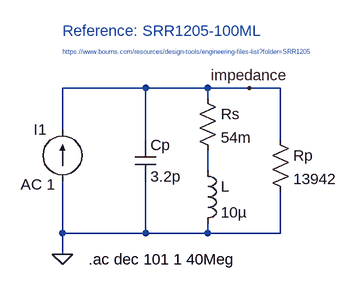
[diagram p0: schematic 06-SRR1205-100ML_bourns_linear_model.asc]
06-SRR1205-100ML_bourns_linear_model.asc, the LTspice schematic file:
Version 4
SHEET 1 1168 680
WIRE 96 64 -32 64
WIRE 192 64 96 64
WIRE 256 64 192 64
WIRE 304 64 256 64
WIRE 192 80 192 64
WIRE -32 128 -32 64
WIRE 96 144 96 64
WIRE 304 144 304 64
WIRE 192 192 192 160
WIRE -32 288 -32 208
WIRE 96 288 96 208
WIRE 96 288 -32 288
WIRE 192 288 192 272
WIRE 192 288 96 288
WIRE 304 288 304 224
WIRE 304 288 192 288
WIRE -32 320 -32 288
FLAG -32 320 0
FLAG 256 64 impedance
SYMBOL res 176 64 R0
SYMATTR InstName Rs
SYMATTR Value 54m
SYMBOL ind 176 176 R0
SYMATTR InstName L
SYMATTR Value 10µ
SYMBOL cap 80 144 R0
SYMATTR InstName Cp
SYMATTR Value 3.2p
SYMBOL res 288 128 R0
SYMATTR InstName Rp
SYMATTR Value 13942
SYMBOL current -32 208 R180
WINDOW 0 24 80 Left 2
WINDOW 3 24 0 Left 2
WINDOW 123 11 -5 Left 2
WINDOW 39 0 0 Left 0
SYMATTR InstName I1
SYMATTR Value ""
SYMATTR Value2 AC 1
TEXT 8 328 Left 2 !.ac dec 101 1 40Meg
TEXT -32 -24 Left 2 ;Reference: SRR1205-100ML
TEXT -32 8 Left 0 ;https://www.bourns.com/resources/design-tools/engineering-files-list?folder=SRR1205

The netlist it stands for:
* 06-SRR1205-100ML_bourns_linear_model.asc
Rs impedance N001 54m
L N001 0 10µ
Cp impedance 0 3.2p
Rp impedance 0 13942
I1 0 impedance AC 1
.ac dec 101 1 40Meg
* Reference: SRR1205-100ML
* https://www.bourns.com/resources/design-tools/engineering-files-list?folder=SRR1205
.backanno
.end

* Results of the author's LTspice run, read from the files saved beside the schematic
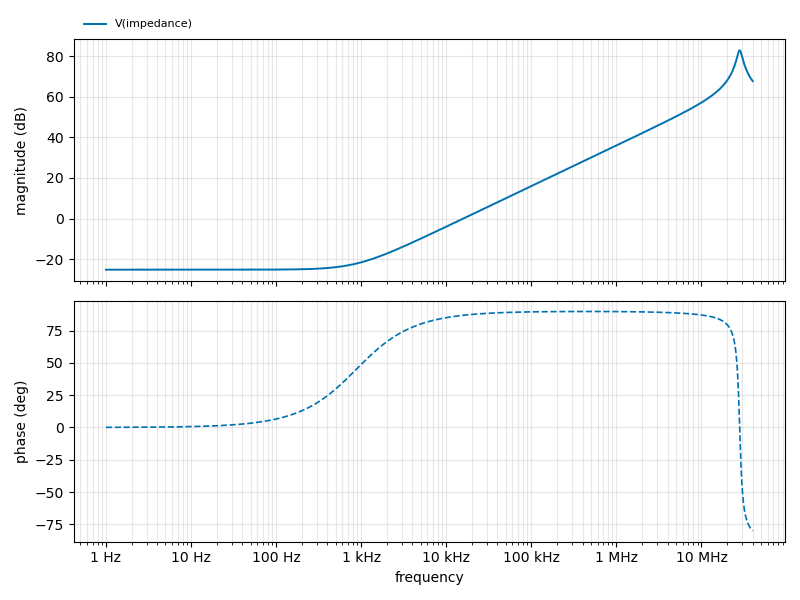
[diagram p1: AC Analysis of 06-SRR1205-100ML_bourns_linear_model.asc, plotted from the saved traces]
* AC Analysis, 1 run:
*   V(impedance): -25.19 dB at 1 Hz, 67.69 dB at 40 MHz, peak 82.81 dB at 27.9 MHz, 3 dB below the peak at 26.38 MHz and 30.01 MHz